# Altium schematic sheet 电子脚铐便携式主控板-MCU.SchDoc
size A4
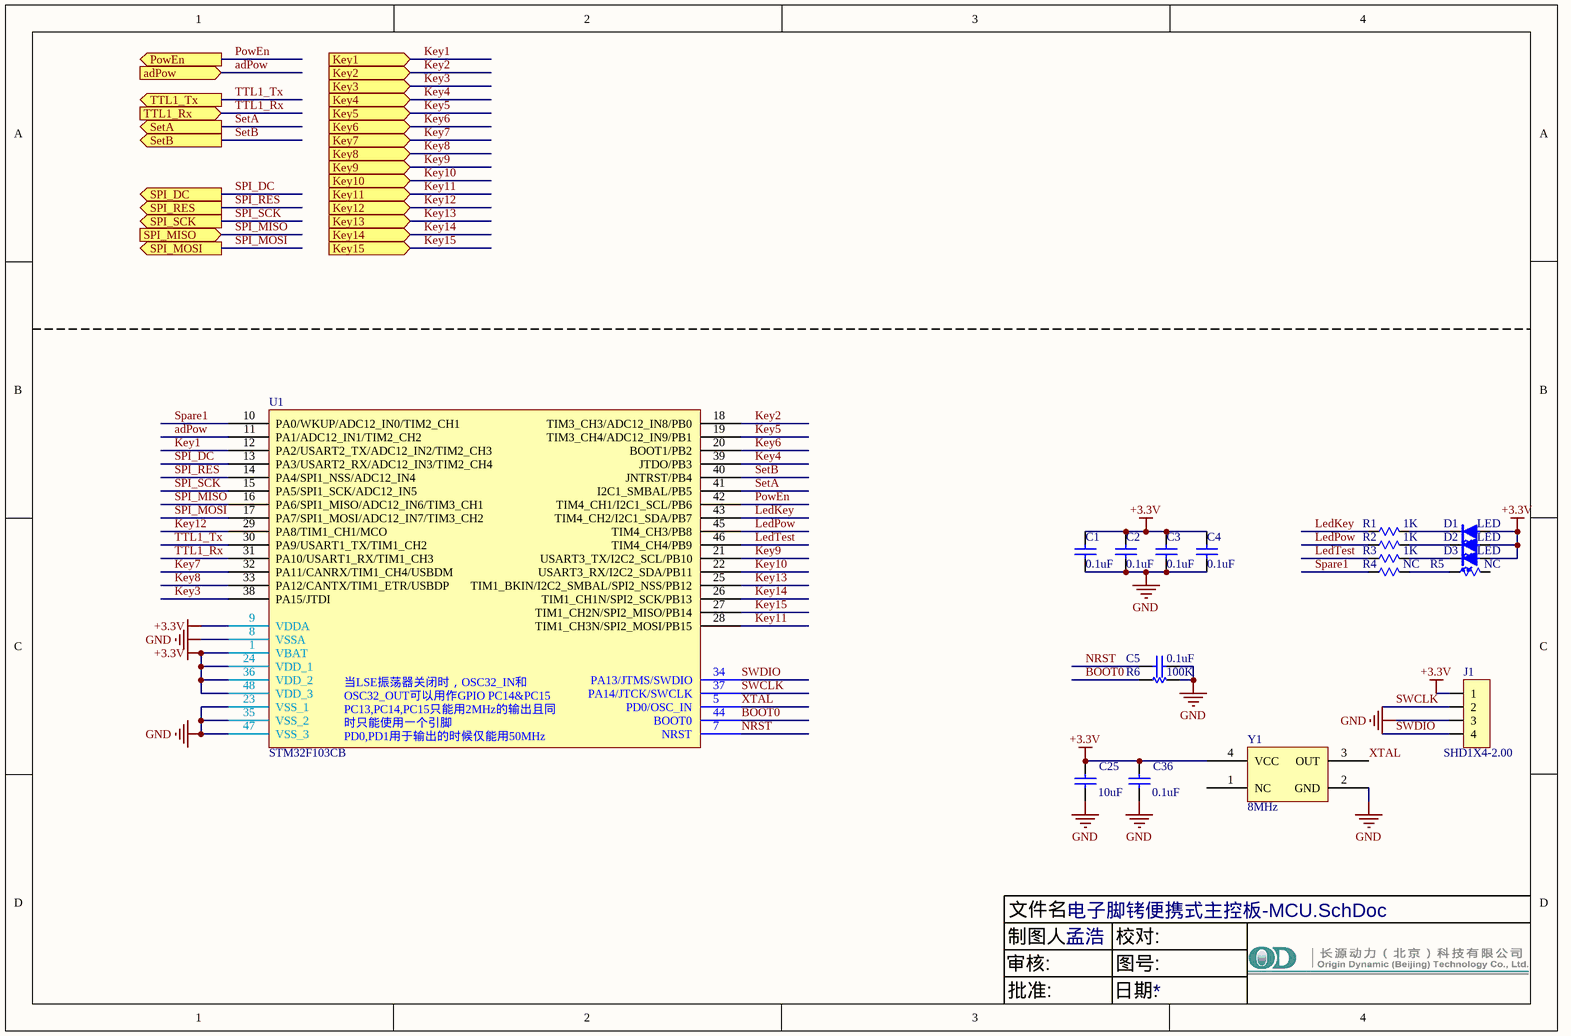
[diagram p0: 电子脚铐便携式主控板-MCU.SchDoc]

## Parts
C1  0.1uF  [C0603]
C2  0.1uF  [C0603]
C3  0.1uF  [C0603]
C4  0.1uF  [C0603]
C5  0.1uF  [C0603]
C25  10uF  [C0603]
C36  0.1uF  [C0603]
D1  LED  [LED0805]
D2  LED  [LED0805]
D3  LED  [LED0805]
J1  SHD1X4-2.00  [Jk1*4-2.0]
R1  1K  [R0603]
R2  1K  [R0603]
R3  1K  [R0603]
R4  NC  [R0603]
R5  NC  [R0603]
R6  100K  [R0603]
U1  STM32F103CB  [LQFP48]
Y1  8MHz  [XTAL5032]

## Ports
adPow (in), Key1 (in), Key2 (in), Key3 (in), Key4 (in), Key5 (in), Key6 (in), Key7 (in), Key8 (in), Key9 (in), Key10 (in), Key11 (in), Key12 (in), Key13 (in), Key14 (in), Key15 (in), PowEn (out), SetA (out), SetB (out), SPI_DC (out), SPI_MISO (in), SPI_MOSI (out), SPI_RES (out), SPI_SCK (out), TTL1_Rx (in), TTL1_Tx (out)

## Nets
+3.3V: C1.1 C2.1 C3.1 C4.1 C25.2 C36.2 D1.1(A) D2.1(A) D3.1(A) J1.1 U1.1(VBAT) U1.9(VDDA) U1.24(VDD_1) U1.36(VDD_2) U1.48(VDD_3) Y1.4(VCC)
GND: C1.2 C2.2 C3.2 C4.2 C5.2 C25.1 C36.1 J1.3 R6.2 U1.8(VSSA) U1.23(VSS_1) U1.35(VSS_2) U1.47(VSS_3) Y1.2(GND)
adPow: U1.11(PA1/ADC12_IN1/TIM2_CH2) ; port adPow
BOOT0: R6.1 U1.44(BOOT0)
Key1: U1.12(PA2/USART2_TX/ADC12_IN2/TIM2_CH3) ; port Key1
Key2: U1.18(TIM3_CH3/ADC12_IN8/PB0) ; port Key2
Key3: U1.38(PA15/JTDI) ; port Key3
Key4: U1.39(JTDO/PB3) ; port Key4
Key5: U1.19(TIM3_CH4/ADC12_IN9/PB1) ; port Key5
Key6: U1.20(BOOT1/PB2) ; port Key6
Key7: U1.32(PA11/CANRX/TIM1_CH4/USBDM) ; port Key7
Key8: U1.33(PA12/CANTX/TIM1_ETR/USBDP) ; port Key8
Key9: U1.21(USART3_TX/I2C2_SCL/PB10) ; port Key9
Key10: U1.22(USART3_RX/I2C2_SDA/PB11) ; port Key10
Key11: U1.28(TIM1_CH3N/SPI2_MOSI/PB15) ; port Key11
Key12: U1.29(PA8/TIM1_CH1/MCO) ; port Key12
Key13: U1.25(TIM1_BKIN/I2C2_SMBAL/SPI2_NSS/PB12) ; port Key13
Key14: U1.26(TIM1_CH1N/SPI2_SCK/PB13) ; port Key14
Key15: U1.27(TIM1_CH2N/SPI2_MISO/PB14) ; port Key15
LedKey: R1.2 U1.43(TIM4_CH2/I2C1_SDA/PB7)
LedPow: R2.2 U1.45(TIM4_CH3/PB8)
LedTest: R3.2 U1.46(TIM4_CH4/PB9)
NRST: C5.1 U1.7(NRST)
PowEn: U1.42(TIM4_CH1/I2C1_SCL/PB6) ; port PowEn
SetA: U1.41(I2C1_SMBAL/PB5) ; port SetA
SetB: U1.40(JNTRST/PB4) ; port SetB
Spare1: R4.2 U1.10(PA0/WKUP/ADC12_IN0/TIM2_CH1)
SPI_DC: U1.13(PA3/USART2_RX/ADC12_IN3/TIM2_CH4) ; port SPI_DC
SPI_MISO: U1.16(PA6/SPI1_MISO/ADC12_IN6/TIM3_CH1) ; port SPI_MISO
SPI_MOSI: U1.17(PA7/SPI1_MOSI/ADC12_IN7/TIM3_CH2) ; port SPI_MOSI
SPI_RES: U1.14(PA4/SPI1_NSS/ADC12_IN4) ; port SPI_RES
SPI_SCK: U1.15(PA5/SPI1_SCK/ADC12_IN5) ; port SPI_SCK
SWCLK: J1.2 U1.37(PA14/JTCK/SWCLK)
SWDIO: J1.4 U1.34(PA13/JTMS/SWDIO)
TTL1_Rx: U1.31(PA10/USART1_RX/TIM1_CH3) ; port TTL1_Rx
TTL1_Tx: U1.30(PA9/USART1_TX/TIM1_CH2) ; port TTL1_Tx
XTAL: U1.5(PD0/OSC_IN) Y1.3(OUT)
NetD1_2: D1.2(K) R1.1
NetD2_2: D2.2(K) R2.1
NetD3_2: D3.2(K) R3.1
NetR4_1: R4.1 R5.2

Not connected (* = marked no-connect by the designer): R5 1; U1 2(PC13-TAMPER-RTC) 3(PC14-OSC32_IN) 4(PC15-OSC32_OUT) 6(PD1/OSC_OUT); Y1 1(NC)

## Notes on the sheet
- 文件名:
- 审核:
- 制图人:
- 孟浩
- 校对:
- 图号:
- 批准:
- 日期:
- (in symbol STM32F103Cx) OSC32_IN和OSC32_OUT可以用作通用IO PC14和PC15; PC13,PC14,PC15只能用于2MHz的输出模式且同时只能使用一个引脚; 当LSE振荡器关闭时，OSC32_IN和OSC32_OUT可以用作GPIO PC14&PC15 / PC13,PC14,PC15只能用2MHz的输出且同时只能使用一个引脚 / PD0,PD1用于输出的时候仅能用50MHz

## Library data of the parts
C1-C5 C25 C36 = Cap Semi
J1 = HEADER1X4
R1-R5 = Res: Resistor; Published: 8-Jun-2000; LatestRevisionDate: 04-Mar-2005; LatestRevisionNote: PCB Footprint replaced.; PackageReference: J1-0603; Publisher: Altium Limited
  R1-R3: Value: 1K
  R4 R5: Value: NC
R6 = Res
U1 = STM32F103Cx
Y1 = XTAL: SM crystal oscilator